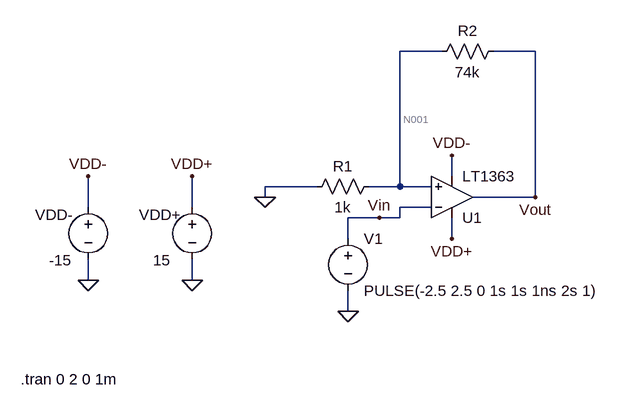
[diagram p0: schematic q5.asc]
q5.asc, the LTspice schematic file:
Version 4.1
SHEET 1 1336 1520
WIRE 176 -64 112 -64
WIRE 320 -64 256 -64
WIRE 192 128 192 96
WIRE -16 144 -96 144
WIRE 112 144 112 -64
WIRE 112 144 64 144
WIRE 160 144 112 144
WIRE -96 160 -96 144
WIRE 320 160 320 -64
WIRE 320 160 224 160
WIRE -368 176 -368 128
WIRE -208 176 -208 128
WIRE 160 176 112 176
WIRE 80 192 32 192
WIRE 112 192 112 176
WIRE 112 192 80 192
WIRE 32 224 32 192
WIRE 192 224 192 192
WIRE -368 288 -368 256
WIRE -208 288 -208 256
WIRE 32 336 32 304
FLAG -368 288 0
FLAG -208 288 0
FLAG -368 128 VDD-
FLAG -208 128 VDD+
FLAG 192 224 VDD+
FLAG 192 96 VDD-
FLAG -96 160 0
FLAG 32 336 0
FLAG 320 160 Vout
FLAG 80 192 Vin
SYMBOL voltage -368 160 R0
WINDOW 0 -82 27 Left 2
WINDOW 3 -60 97 Left 2
WINDOW 123 0 0 Left 0
WINDOW 39 0 0 Left 0
SYMATTR InstName VDD-
SYMATTR Value -15
SYMBOL voltage -208 160 R0
WINDOW 0 -82 27 Left 2
WINDOW 3 -60 97 Left 2
WINDOW 123 0 0 Left 0
WINDOW 39 0 0 Left 0
SYMATTR InstName VDD+
SYMATTR Value 15
SYMBOL res 272 -80 R90
WINDOW 0 0 56 VBottom 2
WINDOW 3 32 56 VTop 2
SYMATTR InstName R2
SYMATTR Value 74k
SYMBOL OpAmps\\LT1363 192 224 M180
SYMATTR InstName U1
SYMBOL voltage 32 208 R0
WINDOW 123 0 0 Left 0
WINDOW 39 0 0 Left 0
SYMATTR InstName V1
SYMATTR Value PULSE(-2.5 2.5 0 1s 1s 1ns 2s 1)
SYMBOL res 80 128 R90
WINDOW 0 0 56 VBottom 2
WINDOW 3 32 56 VTop 2
SYMATTR InstName R1
SYMATTR Value 1k
TEXT -472 440 Left 2 !.tran 0 2 0 1m

The netlist it stands for:
* q5.asc
VDD- VDD- 0 -15
VDD+ VDD+ 0 15
R2 Vout N001 74k
X§U1 N001 Vin VDD+ VDD- Vout LT1363  ; pins In+ In- V+ V- OUT
V1 Vin 0 PULSE(-2.5 2.5 0 1s 1s 1ns 2s 1)
R1 N001 0 1k
.tran 0 2 0 1m
.lib LT1363.sub
.backanno
.end

* Results of the author's LTspice run, read from the files saved beside the schematic
* Operating Point, zero values left out:
*   V(vdd+) = 15 V
*   V(n001) = 189.4 mV
*   V(vin) = -2.5 V
*   V(vdd-) = -15 V
*   V(vout) = 14.29 V
*   I(VDD-) = 6.222 mA
*   I(R2) = 190.5 µA
*   I(R1) = 189.4 µA
*   I(V1) = -12.72 nA
*   I(VDD+) = -6.411 mA
*   Ix(u1:1) = 1.142 µA
*   Ix(u1:2) = 12.72 nA
*   Ix(u1:3) = 6.411 mA
*   Ix(u1:4) = -6.222 mA
*   Ix(u1:5) = -190.5 µA
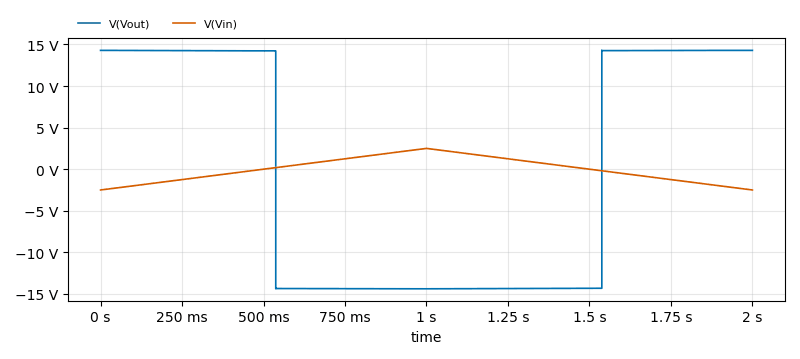
[diagram p1: Transient Analysis of q5.asc, plotted from the saved traces]
* Transient Analysis, 1 run:
*   V(Vout): min -14.38 V, max 14.29 V, average -53.16 mV, rms 14.31 V, last 14.29 V
*   V(Vin): min -2.5 V, max 2.499 V, average -22.06 µV, rms 1.722 V, last -2.5 V